# EAGLE schematic preliminary (EAGLE 9.2.0)
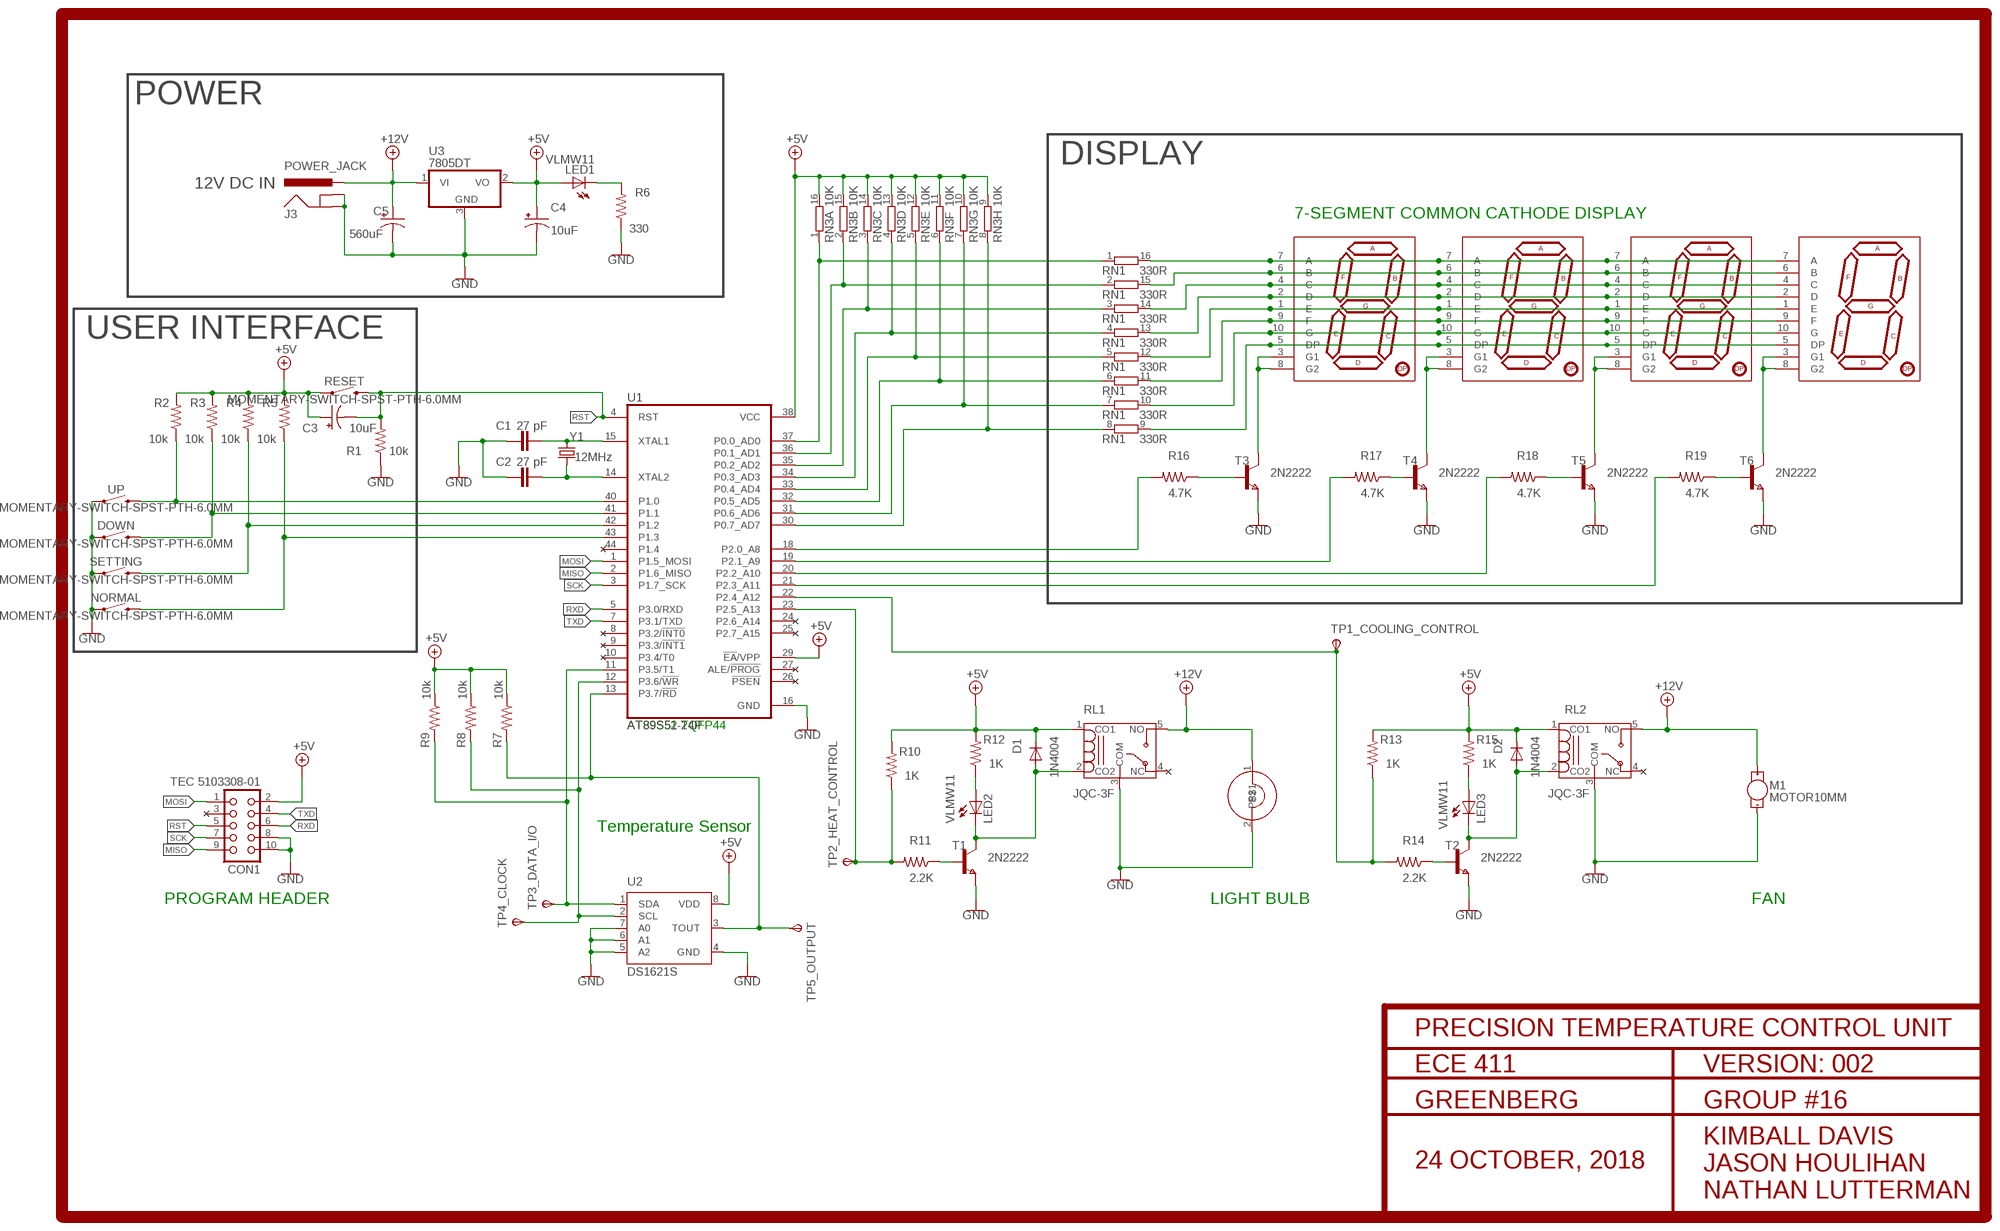
[diagram p0: schematic, sheet 1]

## Parts
C1  27 pF  CAPACITOR_0603_M  [RESC0603_M]
C2  27 pF  CAPACITOR_0603_M  [RESC0603_M]
C3  10uF  10UF-POLAR-0603-6.3V-20%(TANT)  [0603-POLAR]
C4  10uF  10UF-POLAR-0603-6.3V-20%(TANT)  [0603-POLAR]
C5  560uF  560UF-PANASONIC_G-25V-20%  [PANASONIC_G]
CON1  TEC 5103308-01  CON10  [CON10]
D1  1N4004  [DO41-10]
D2  1N4004  [DO41-10]
DOWN  MOMENTARY-SWITCH-SPST-PTH-6.0MM  [TACTILE_SWITCH_PTH_6.0MM]
J3  POWER_JACK  [POWER_JACK_PTH]
LED1  VLMW11  LEDCHIP-LED0603  [CHIP-LED0603]
LED2  VLMW11  LEDCHIP-LED0603  [CHIP-LED0603]
LED3  VLMW11  LEDCHIP-LED0603  [CHIP-LED0603]
M1  MOTOR10MM  [VIBE-MOTOR-10MM]
NORMAL  MOMENTARY-SWITCH-SPST-PTH-6.0MM  [TACTILE_SWITCH_PTH_6.0MM]
R1  10k  R-US_R0603  [R0603]
R2  10k  R-US_R0603  [R0603]
R3  10k  R-US_R0603  [R0603]
R4  10k  R-US_R0603  [R0603]
R5  10k  R-US_R0603  [R0603]
R6  330  R-US_R0603  [R0603]
R7  10k  R-US_R0603  [R0603]
R8  10k  R-US_R0603  [R0603]
R9  10k  R-US_R0603  [R0603]
R10  1K  R-US_R0603  [R0603]
R11  2.2K  R-US_R0603  [R0603]
R12  1K  R-US_R0603  [R0603]
R13  1K  R-US_R0603  [R0603]
R14  2.2K  R-US_R0603  [R0603]
R15  1K  R-US_R0603  [R0603]
R16  4.7K  R-US_R0603  [R0603]
R17  4.7K  R-US_R0603  [R0603]
R18  4.7K  R-US_R0603  [R0603]
R19  4.7K  R-US_R0603  [R0603]
RESET  MOMENTARY-SWITCH-SPST-PTH-6.0MM  [TACTILE_SWITCH_PTH_6.0MM]
RL1  JQC-3F  [T073]
RL2  JQC-3F  [T073]
RN1  330R  8R-PSOMC  [SOMC16]
RN3  10K  8R-NSOMC  [SOMC16]
SETTING  MOMENTARY-SWITCH-SPST-PTH-6.0MM  [TACTILE_SWITCH_PTH_6.0MM]
T1  2N2222  NPNSOT23  [SOT-23]
T2  2N2222  NPNSOT23  [SOT-23]
T3  2N2222  NPNSOT23  [SOT-23]
T4  2N2222  NPNSOT23  [SOT-23]
T5  2N2222  NPNSOT23  [SOT-23]
T6  2N2222  NPNSOT23  [SOT-23]
TP1_COOLING_CONTROL  TPSTP20SQ  [TP20SQ]
TP2_HEAT_CONTROL  TPSTP20SQ  [TP20SQ]
TP3_DATA_I/O  TPSTP20SQ  [TP20SQ]
TP4_CLOCK  TPSTP20SQ  [TP20SQ]
TP5_OUTPUT  TPSTP20SQ  [TP20SQ]
U1  AT89S51-24P  [TQFP44]
U2  DS1621S  [SO08]
U3  7805DT  [TO252]
U$1  YSD-160AB3C-8  7-SEGMENT-1DIGIT-1INCH-BLUE  [7-SEGMENT-1"PTH]
U$2  YSD-160AB3C-8  7-SEGMENT-1DIGIT-1INCH-BLUE  [7-SEGMENT-1"PTH]
U$3  YSD-160AB3C-8  7-SEGMENT-1DIGIT-1INCH-BLUE  [7-SEGMENT-1"PTH]
U$4  YSD-160AB3C-8  7-SEGMENT-1DIGIT-1INCH-BLUE  [7-SEGMENT-1"PTH]
U$18  LIGHTBULB  [JUMPER2]
UP  MOMENTARY-SWITCH-SPST-PTH-6.0MM  [TACTILE_SWITCH_PTH_6.0MM]
Y1  12MHz  CRYSTAL-12MHZ"  [CRYSTAL-SMD-5X3.2-4PAD]

## Nets
+5V: C3.+ C4.+ CON1.2 D1.C D2.C LED1.A R2.2 R3.2 R4.2 R5.2 R7.1 R8.1 R9.1 R10.2 R12.2 R13.2 R15.2 RESET.1 RL1.1(CO1) RL2.1(CO1) RN3.9 RN3.10 RN3.11 RN3.12 RN3.13 RN3.14 RN3.15 RN3.16 U1.29(!EA!/VPP) U1.38(VCC) U2.8(VDD) U3.2(VO)
+12V: C5.+ J3.PWR M1.+ RL1.5(NO) RL2.5(NO) U3.1(VI) U$18.1
GND: C1.1 C2.1 C4.- C5.- CON1.8 CON1.10 DOWN.1 J3.GND J3.GNDBREAK M1.- NORMAL.1 R1.1 R6.1 RL1.3(COM) RL2.3(COM) SETTING.1 T1.2(E) T2.2(E) T3.2(E) T4.2(E) T5.2(E) T6.2(E) U1.16(GND) U2.4(GND) U2.5(A2) U2.6(A1) U2.7(A0) U3.3(GND) U$18.2 UP.1
MISO: CON1.9 U1.2(P1.6_MISO)
MOSI: CON1.1 U1.1(P1.5_MOSI)
N$1: C1.2 U1.15(XTAL1) Y1.1
N$2: C2.2 U1.14(XTAL2) Y1.3
N$4: R2.1 U1.40(P1.0) UP.3
N$5: DOWN.3 R3.1 U1.41(P1.1)
N$6: R4.1 SETTING.3 U1.42(P1.2)
N$7: NORMAL.3 R5.1 U1.43(P1.3)
N$8: LED1.C R6.2
N$9: R7.2 TP5_OUTPUT.TP(PP) U1.13(P3.7/!RD) U2.3(TOUT)
N$10: R8.2 TP4_CLOCK.TP(PP) U1.12(P3.6/!WR) U2.2(SCL)
N$11: R9.2 TP3_DATA_I/O.TP(PP) U1.11(P3.5/T1) U2.1(SDA)
N$12: R10.1 R11.2 TP2_HEAT_CONTROL.TP(PP) U1.23(P2.5_A13)
N$13: R11.1 T1.3(B)
N$14: D1.A LED2.C RL1.2(CO2) T1.1(C)
N$15: LED2.A R12.1
N$16: R13.1 R14.2 TP1_COOLING_CONTROL.TP(PP) U1.22(P2.4_A12)
N$17: R14.1 T2.3(B)
N$18: RN1.8 RN3.8 U1.30(P0.7_AD7)
N$20: D2.A LED3.C RL2.2(CO2) T2.1(C)
N$21: LED3.A R15.1
N$22: RN1.1 RN3.1 U1.37(P0.0_AD0)
N$25: RN1.2 RN3.2 U1.36(P0.1_AD1)
N$26: RN1.3 RN3.3 U1.35(P0.2_AD2)
N$27: RN1.4 RN3.4 U1.34(P0.3_AD3)
N$28: RN1.5 RN3.5 U1.33(P0.4_AD4)
N$29: RN1.6 RN3.6 U1.32(P0.5_AD5)
N$30: RN1.7 RN3.7 U1.31(P0.6_AD6)
N$32: RN1.16 U$1.7(A) U$2.7(A) U$3.7(A) U$4.7(A)
N$33: RN1.15 U$1.6(B) U$2.6(B) U$3.6(B) U$4.6(B)
N$34: RN1.14 U$1.4(C) U$2.4(C) U$3.4(C) U$4.4(C)
N$35: RN1.13 U$1.2(D) U$2.2(D) U$3.2(D) U$4.2(D)
N$36: RN1.12 U$1.1(E) U$2.1(E) U$3.1(E) U$4.1(E)
N$37: RN1.11 U$1.9(F) U$2.9(F) U$3.9(F) U$4.9(F)
N$38: RN1.10 U$1.10(G) U$2.10(G) U$3.10(G) U$4.10(G)
N$39: RN1.9 U$1.5(DP) U$2.5(DP) U$3.5(DP) U$4.5(DP)
N$40: R16.2 U1.18(P2.0_A8)
N$41: R16.1 T3.3(B)
N$42: T3.1(C) U$2.3(G1) U$2.8(G2)
N$43: R17.2 U1.19(P2.1_A9)
N$44: R17.1 T4.3(B)
N$45: T4.1(C) U$3.3(G1) U$3.8(G2)
N$46: R18.2 U1.20(P2.2_A10)
N$47: R18.1 T5.3(B)
N$48: T5.1(C) U$4.3(G1) U$4.8(G2)
N$49: R19.2 U1.21(P2.3_A11)
N$50: R19.1 T6.3(B)
N$51: T6.1(C) U$1.3(G1) U$1.8(G2)
RST: C3.- CON1.5 R1.2 RESET.3 U1.4(RST)
RXD: CON1.6 U1.5(P3.0/RXD)
SCK: CON1.7 U1.3(P1.7_SCK)
TXD: CON1.4 U1.7(P3.1/TXD)
Unconnected: CON1.3 RL1.4(NC) RL2.4(NC) U1.8(P3.2/!INT0) U1.9(P3.3/!INT1) U1.10(P3.4/T0) U1.24(P2.6_A14) U1.25(P2.7_A15) U1.26(!PSEN) U1.27(ALE/!PROG) U1.44(P1.4)

## Notes on the sheet
- POWER
- DISPLAY
- 12V DC IN
- 7-SEGMENT COMMON CATHODE DISPLAY
- USER INTERFACE
- AT89S52 TQFP44
- Temperature Sensor
- PROGRAM HEADER | LIGHT BULB | FAN

## Power pins joined to a net without a drawn wire
GND: U1.17(GND)

## Library data of the parts
C1 C2 = Nordic_nRF:CAPACITOR: Generic chip capacitor
C3 C4 = SparkFun-Capacitors:10UF-POLAR: 10.0µF polarized capacitors A capacitor is a passive two-terminal electrical component used to store electrical energy temporarily in an electric field.; PROD_ID: CAP-13210
C5 = SparkFun-Capacitors:560UF: 560µF polarized capacitors A capacitor is a passive two-terminal electrical component used to store electrical energy temporarily in an electric field.; PROD_ID: CAP-09983
CON1 = con-harting:CON10: CONNECTOR; OC_FARNELL: unknown; OC_NEWARK: unknown
D1 D2 = diode:1N4004: DIODE general purpose rectifier, 1 A
DOWN NORMAL RESET SETTING UP = SparkFun-Switches:MOMENTARY-SWITCH-SPST: Momentary Switch (Pushbutton) - SPST Normally-open (NO) SPST momentary switches (buttons, pushbuttons). Variants PTH-12MM - 12mm square, through-hole Momentary Pushbutton Switch - 12mm Square <https://www.sparkfun.com/products/9190> (COM-09190) PTH-6.0MM, PTH-6.0MM-KIT - 6.0mm square, through-hole Mini Pushbutton Switch <https://www.sparkfun.com/products/97> (COM-00097) KIT package intended for soldering kit's - only one side of pads' copper is exposed. PTH-RIGHT-ANGLE-KIT - Right-angle, through-hole Right Angle Tactile Button <https://www.sparkfun.com/products/10791> - Used on SparkFun BigTime Watch Kit <https://www.sparkfun.com/products/11734> SMD-12MM - 12mm square, surface-mount Tactile Button - SMD (12mm) <https://www.sparkfun.com/products/12993> (COM-12993) Used on SparkFun PicoBoard <https://www.sparkfun.com/products/11888> SMD-4.5MM - 4.5mm Square Trackball Switch Used on SparkFun Blackberry Trackballer Breakout <https://www.sparkfun.com/products/13169> SMD-4.6MMX2.8MM - 4.60mm x 2.80mm, surface mount Used on SparkFun SAMD21 Mini Breakout <https://www.sparkfun.com/products/13664> SMD-5.2MM, SMD-5.2-REDUNDANT - 5.2mm square, surface-mount Mini Pushbutton Switch - SMD <https://www.sparkfun.com/products/8720> (COM-08720) Used on Arduino Pro Mini <https://www.sparkfun.com/products/11114> REDUNDANT package connects both switch circuits together SMD-6.0X3.5MM - 6.0 x 3.5mm, surface mount Momentary Reset Switch SMD <https://www.sparkfun.com/products/8229> (COM-08229) SMD-6.2MM-TALL - 6.2mm square, surface mount Tactile Button - SMD (6mm) <https://www.sparkfun.com/products/12992> Used on SparkFun Digital Sandbox <https://www.sparkfun.com/products/12651> SMD-RIGHT-ANGLE - Right-angle, surface mount Used on SparkFun Block for Intel® Edison - Arduino <https://www.sparkfun.com/products/13036>; PROD_ID: SWCH-08441; SF_SKU: COM-00097
J3 = SparkFun-Connectors:POWER_JACK: Power Jack Connector This is the standard 5.5mm barrel jack for power. The PTH is the most common, proven, reliable, footprint. The Slot footprint only works if the mill layer is transmitted to the PCB fab house so be warned. Here are the connectors we sell at SparkFun: DC Barrel Power Jack/Connector <https://www.sparkfun.com/products/119> (PRT-00119) DC Barrel Power Jack/Connector (SMD) <https://www.sparkfun.com/products/12748> (PRT-12748) DC Barrel Jack Adapter - Breadboard Compatible <https://www.sparkfun.com/products/10811> (PRT-10811) It is used on this SparkFun product (and many, many others): SparkFun RedBoard - Programmed with Arduino <https://www.sparkfun.com/products/12757> (DEV-12757) Also, if you need a mating power supply or connector, please check these out: Wall Adapter Power Supply - 9VDC 650mA <https://www.sparkfun.com/products/298> (TOL-00298) DC Barrel Jack Adapter - Male <https://www.sparkfun.com/products/10287> (PRT-10287); PROD_ID: CONN-08197
LED1-LED3 = led:LED: LED OSRAM: - CHIPLED LG R971, LG N971, LY N971, LG Q971, LY Q971, LO R971, LY R971 LH N974, LH R974 LS Q976, LO Q976, LY Q976 LO Q996 - Hyper CHIPLED LW Q18S LB Q993, LB Q99A, LB R99A - SideLED LS A670, LO A670, LY A670, LG A670, LP A670 LB A673, LV A673, LT A673, LW A673 LH A674 LY A675 LS A676, LA A676, LO A676, LY A676, LW A676 LS A679, LY A679, LG A679 - Hyper Micro SIDELED® LS Y876, LA Y876, LO Y876, LY Y876 LT Y87S - SmartLED LW L88C, LW L88S LB L89C, LB L89S, LG L890 LS L89K, LO L89K, LY L89K LS L896, LA L896, LO L896, LY L896 - TOPLED LS T670, LO T670, LY T670, LG T670, LP T670 LSG T670, LSP T670, LSY T670, LOP T670, LYG T670 LG T671, LOG T671, LSG T671 LB T673, LV T673, LT T673, LW T673 LH T674 LS T676, LA T676, LO T676, LY T676, LB T676, LH T676, LSB T676, LW T676 LB T67C, LV T67C, LT T67C, LS T67K, LO T67K, LY T67K, LW E67C LS E67B, LA E67B, LO E67B, LY E67B, LB E67C, LV E67C, LT E67C LW T67C LS T679, LY T679, LG T679 LS T770, LO T770, LY T770, LG T770, LP T770 LB T773, LV T773, LT T773, LW T773 LH T774 LS E675, LA E675, LY E675, LS T675 LS T776, LA T776, LO T776, LY T776, LB T776 LHGB T686 LT T68C, LB T68C - Hyper Mini TOPLED® LB M676 - Mini TOPLED Santana® LG M470 LS M47K, LO M47K, LY M47K Source: http://www.osram.convergy.de LUXEON: - LUMILED® LXK2-PW12-R00, LXK2-PW12-S00, LXK2-PW14-U00, LXK2-PW14-V00 LXK2-PM12-R00, LXK2-PM12-S00, LXK2-PM14-U00 LXK2-PE12-Q00, LXK2-PE12-R00, LXK2-PE12-S00, LXK2-PE14-T00, LXK2-PE14-U00 LXK2-PB12-K00, LXK2-PB12-L00, LXK2-PB12-M00, LXK2-PB14-N00, LXK2-PB14-P00, LXK2-PB14-Q00 LXK2-PR12-L00, LXK2-PR12-M00, LXK2-PR14-Q00, LXK2-PR14-R00 LXK2-PD12-Q00, LXK2-PD12-R00, LXK2-PD12-S00 LXK2-PH12-R00, LXK2-PH12-S00 LXK2-PL12-P00, LXK2-PL12-Q00, LXK2-PL12-R00 Source: www.luxeon.com KINGBRIGHT: KA-3528ASYC Source: www.kingbright.com
M1 = SparkFun-Electromechanical:MOTOR: Motor (Single-Phase) Two-terminal, single-phase motors. SparkFun Products Vibration Motor <https://www.sparkfun.com/products/8449> (ROB-08449) Physical dimension and wire connections for this powerful vibration motor. Motor has a self adhesive backing.; PROD_ID: COMP-08572; SF_SKU: ROB-08449
R1-R19 = audio amplifier example:R-US_: RESISTOR, American symbol
RL1 RL2 = JQC-3F:JQC-3F
RN1 = resistor-dil:8R-P: DIL RESISTOR; OC_FARNELL: unknown; OC_NEWARK: unknown
RN3 = resistor-dil:8R-N: DIL RESISTOR; OC_FARNELL: unknown; OC_NEWARK: unknown
T1-T6 = zetex:NPNSOT23: NPN TRANSISTOR; MPN: DSS20201L-7; OC_FARNELL: 1710688; OC_NEWARK: 25R4555
TP1_COOLING_CONTROL TP2_HEAT_CONTROL TP3_DATA_I/O TP4_CLOCK TP5_OUTPUT = testpad:TPS: TEST PIN
U1 = atmel:AT89S51*P: 8-bit Microcontroller with 4K BytesIn-System Programmable Flash Source: http://www.atmel.com/dyn/resources/prod_documents/doc2487.pdf; OC_FARNELL: unknown; OC_NEWARK: unknown
U2 = maxim:DS1621: Digital Thermometer and Thermostat Source: http://pdfserv.maxim-ic.com/en/ds/DS1621.pdf; MF: DALLAS SEMICONDUCTOR; MPN: DS1621S+; OC_FARNELL: 9725261; OC_NEWARK: 23K3501
U3 = linear:78*: Positive VOLTAGE REGULATOR Source: http://cache.national.com/ds/LM/LM78L05.pdf http://www.fairchildsemi.com/ds/LM/LM7805.pdf
U$1-U$4 = SparkFun-LED:7-SEGMENT-1DIGIT-1INCH: 7-Segment Display, single digit, 1" EZ is for kits. Pads are only exposed on the bottom side to help prevent soldering in upside down. Datasheet (Red) <https://cdn.sparkfun.com/datasheets/Components/LED/YSD-160AR4B-8.pdf> Datasheet (Blue) <https://cdn.sparkfun.com/datasheets/Components/LED/YSD-160AB3C-8.pdf> SparkFun Products 7-Segment Display - LED (Red) <https://www.sparkfun.com/products/8546> (COM-08546) 7-Segment Display - LED (Blue) <https://www.sparkfun.com/products/9191> (COM-09191); PROD_ID: COMP-09495
U$18 = LIGHTBULB:LIGHTBULB
Y1 = SparkFun-Clocks:CRYSTAL-12MHZ: 12.0MHz Crystal Frequency: 12.0MHz Frequency Tolerance: ±20ppm Load Capacitance: 18pF SparkFun Products: SparkFun Logomatic <https://www.sparkfun.com/products/12772> Pocket AVR Programmer <https://www.sparkfun.com/products/9825>; PROD_ID: XTAL-08297